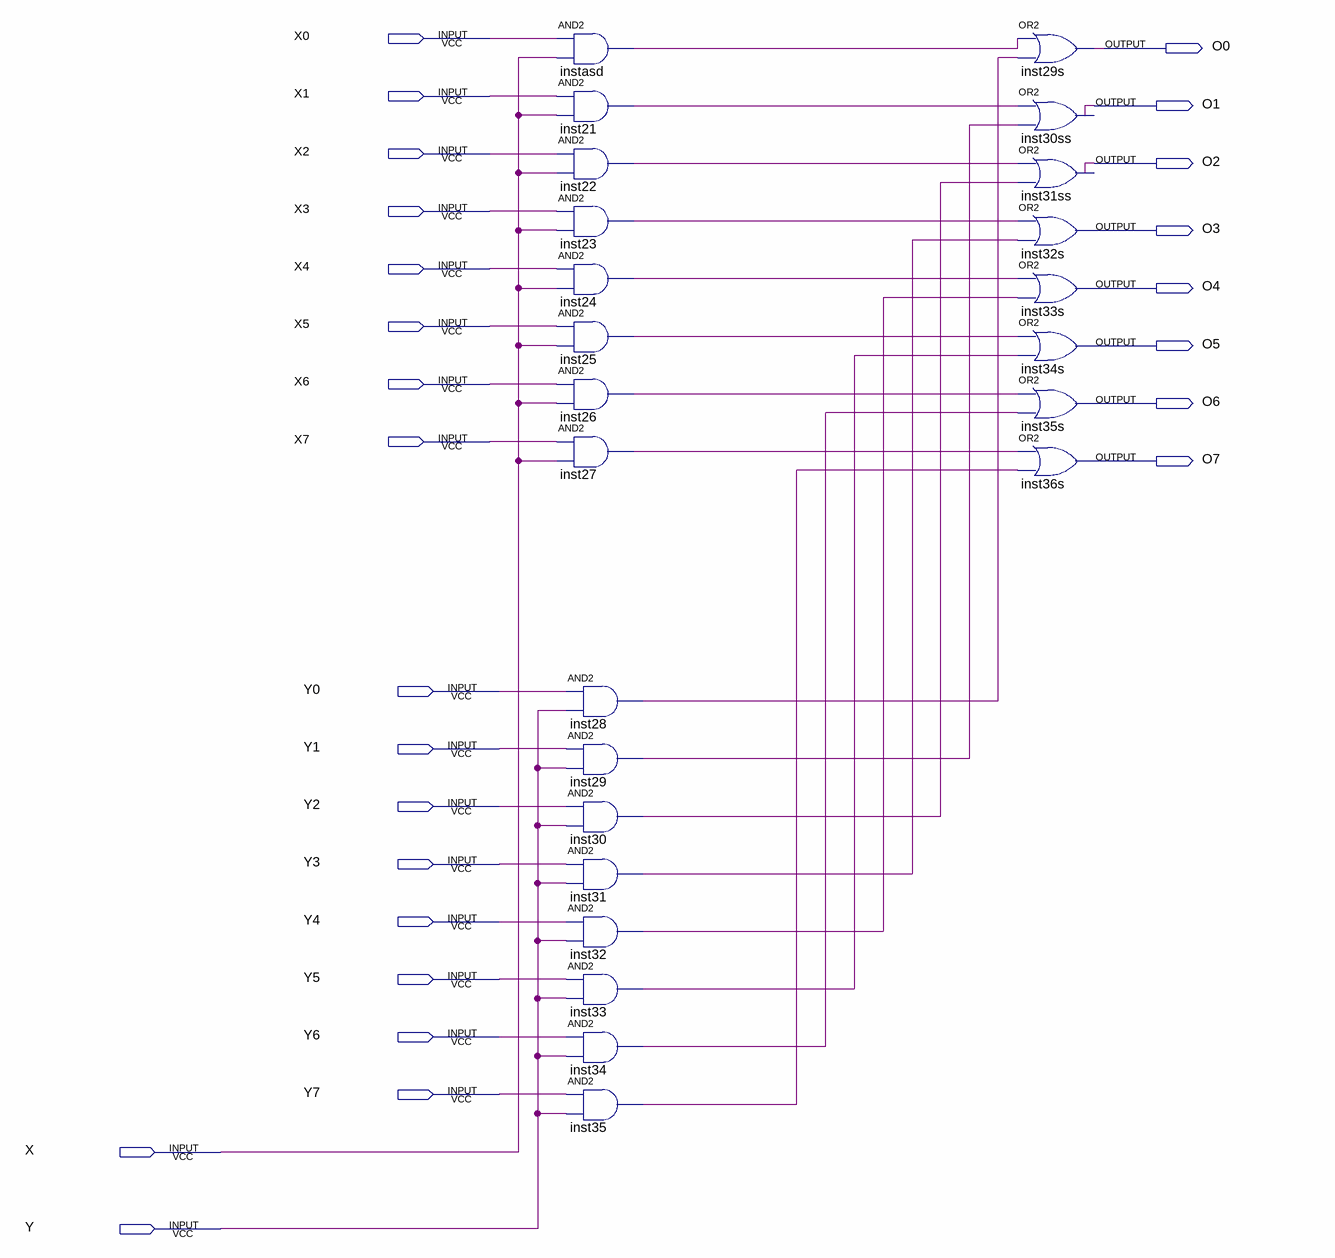
[diagram p0: schematic sheet]
// Quartus schematic Select.bdf as structural Verilog: 24 symbols, 26 pins
module Select (
  input  X0,
  input  X1,
  input  X2,
  input  X3,
  input  X4,
  input  X5,
  input  X6,
  input  X7,
  input  Y0,
  input  Y1,
  input  Y2,
  input  Y3,
  input  Y4,
  input  Y5,
  input  Y6,
  input  Y7,
  input  X,
  input  Y,
  output O0,
  output O1,
  output O2,
  output O3,
  output O4,
  output O5,
  output O6,
  output O7
);

  wire inst21_out, inst22_out, inst23_out, inst24_out, inst25_out, inst26_out, inst27_out, inst28_out,
       inst29_out, inst30_out, inst31_out, inst32_out, inst33_out, inst34_out, inst35_out, instasd_out;

  and instasd (instasd_out, X0, X);
  and inst21 (inst21_out, X1, X);
  and inst22 (inst22_out, X2, X);
  and inst23 (inst23_out, X3, X);
  and inst24 (inst24_out, X4, X);
  and inst25 (inst25_out, X5, X);
  and inst26 (inst26_out, X6, X);
  and inst27 (inst27_out, X7, X);
  and inst28 (inst28_out, Y0, Y);
  and inst29 (inst29_out, Y1, Y);
  and inst30 (inst30_out, Y2, Y);
  and inst31 (inst31_out, Y3, Y);
  and inst32 (inst32_out, Y4, Y);
  and inst33 (inst33_out, Y5, Y);
  and inst34 (inst34_out, Y6, Y);
  and inst35 (inst35_out, Y7, Y);
  or inst29s (O0, instasd_out, inst28_out);
  or inst30ss (O1, inst21_out, inst29_out);
  or inst31ss (O2, inst22_out, inst30_out);
  or inst32s (O3, inst23_out, inst31_out);
  or inst33s (O4, inst24_out, inst32_out);
  or inst34s (O5, inst25_out, inst33_out);
  or inst35s (O6, inst26_out, inst34_out);
  or inst36s (O7, inst27_out, inst35_out);
endmodule
